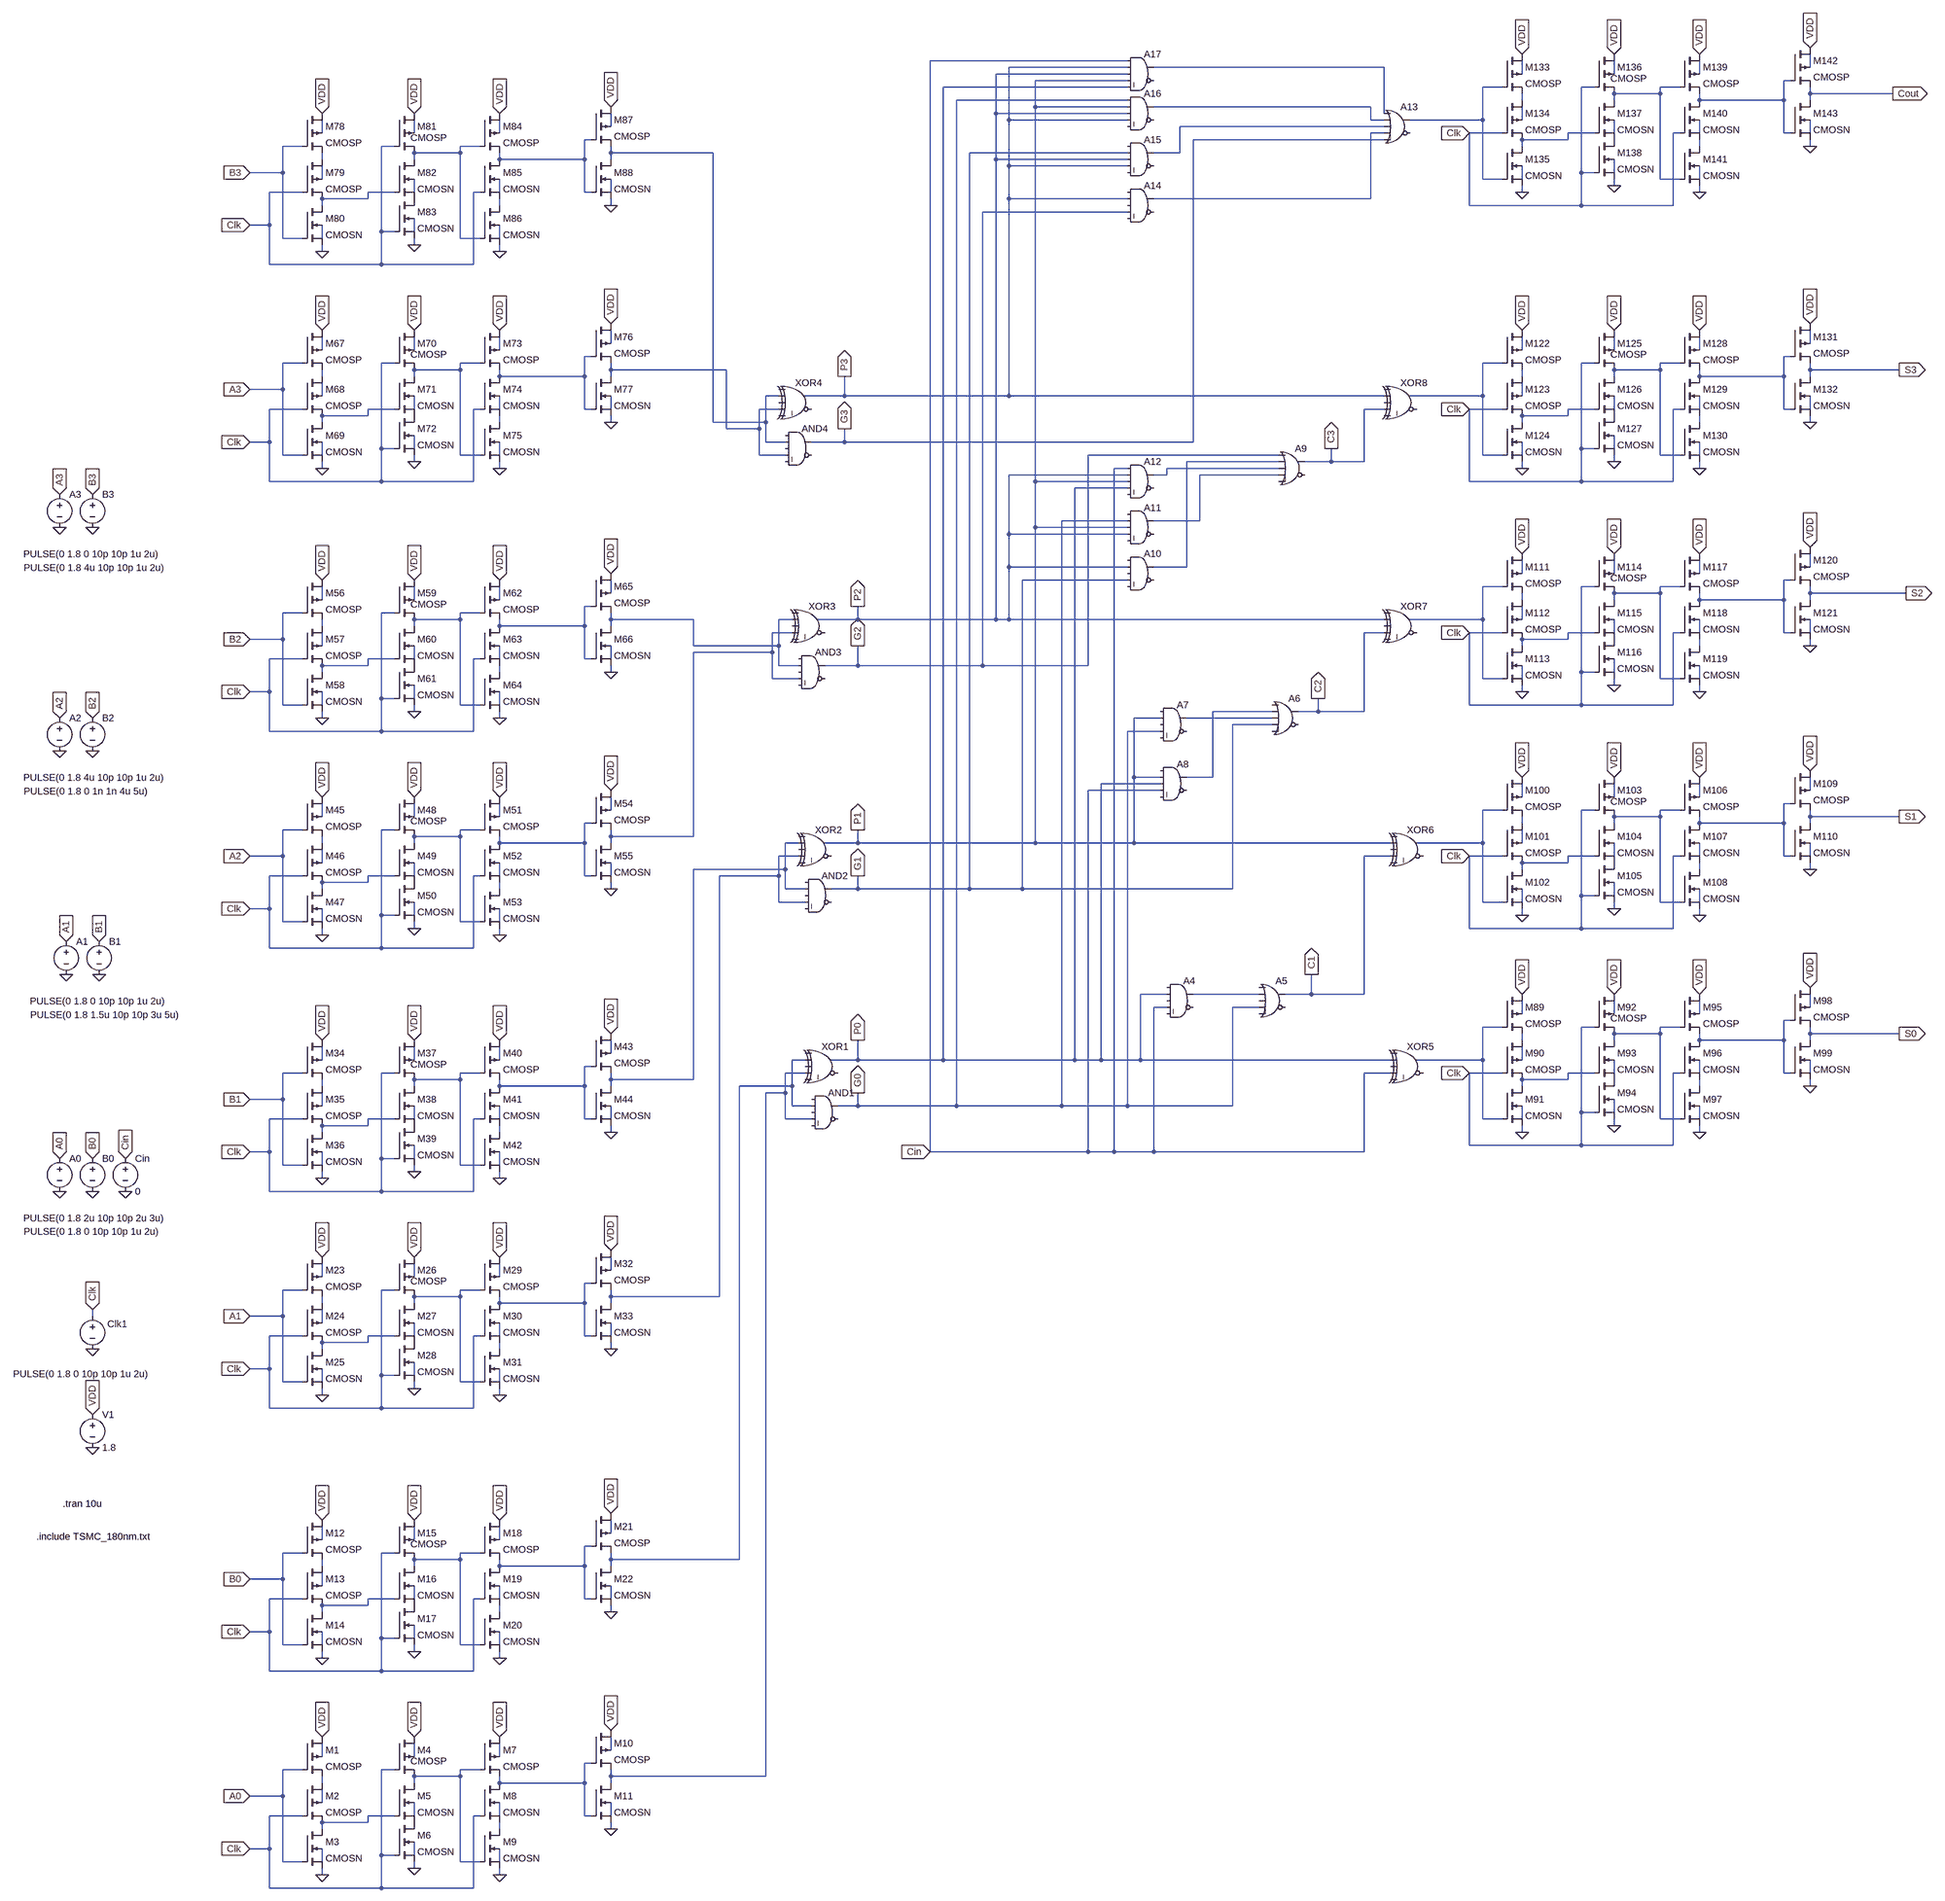
[diagram p0: schematic cla_adder_static_logic.asc]
* cla_adder_static_logic.asc
AND1 0 N161 0 N165 0 0 G0 0 AND
A§XOR1 0 N161 0 N165 0 0 P0 0 XOR
V§B0 B0 0 PULSE(0 1.8 0 10p 10p 1u 2u)
V§Cin Cin 0 0
V§A0 A0 0 PULSE(0 1.8 2u 10p 10p 2u 3u)
AND2 0 N128 0 N130 0 0 G1 0 AND
A§XOR2 0 N128 0 N130 0 0 P1 0 XOR
V§B1 B1 0 PULSE(0 1.8 1.5u 10p 10p 3u 5u)
V§A1 A1 0 PULSE(0 1.8 0 10p 10p 1u 2u)
AND3 0 N090 0 N093 0 0 G2 0 AND
A§XOR3 0 N090 0 N093 0 0 P2 0 XOR
V§B2 B2 0 PULSE(0 1.8 0 1n 1n 4u 5u)
V§A2 A2 0 PULSE(0 1.8 4u 10p 10p 1u 2u)
AND4 0 N025 0 N052 0 0 G3 0 AND
A§XOR4 0 N025 0 N052 0 0 P3 0 XOR
V§B3 B3 0 PULSE(0 1.8 4u 10p 10p 1u 2u)
V§A3 A3 0 PULSE(0 1.8 0 10p 10p 1u 2u)
A§XOR7 0 P2 0 C2 0 0 N081 0 XOR
A§XOR6 0 P1 0 C1 0 0 N119 0 XOR
A§XOR5 0 P0 0 Cin 0 0 N154 0 XOR
A§XOR8 0 P3 0 C3 0 0 N050 0 XOR
A4 0 P0 0 Cin 0 0 N148 0 AND
A5 0 N148 0 G0 0 0 C1 0 OR
A6 0 N111 N112 G1 0 0 C2 0 OR
A7 0 P1 0 G0 0 0 N112 0 AND
A8 0 P1 P0 Cin 0 0 N111 0 AND
A9 G2 N073 N074 N075 0 0 C3 0 OR
A10 0 P2 0 G1 0 0 N073 0 AND
A11 0 G0 P1 P2 0 0 N075 0 AND
A12 Cin P2 P1 P0 0 0 N074 0 AND
A13 N001 N010 N013 N017 G3 0 N007 0 OR
A14 0 P3 0 G2 0 0 N017 0 AND
A15 0 G1 P2 P3 0 0 N013 0 AND
A16 G0 P1 P2 P3 0 0 N010 0 AND
A17 Cin P3 P2 P1 P0 0 N001 0 AND
V§Clk1 Clk 0 PULSE(0 1.8 0 10p 10p 1u 2u)
V1 VDD 0 1.8
M1 VDD A0 N222 N217 CMOSP l=0.18u w=3.6u
M2 N222 Clk N224 N223 CMOSP l=0.18u w=3.6u
M3 N224 A0 0 N230 CMOSN l=0.18u w=1.8u
M4 VDD Clk N221 N218 CMOSP l=0.18u w=3.6u
M5 N221 N224 P001 N225 CMOSN l=0.18u w=1.8u
M6 P001 Clk 0 N229 CMOSN l=0.18u w=1.8u
M7 VDD N221 N220 N219 CMOSP l=0.18u w=3.6u
M8 N220 Clk N228 N226 CMOSN l=0.18u w=1.8u
M9 N228 N221 0 N231 CMOSN l=0.18u w=1.8u
M10 VDD N220 N165 N216 CMOSP l=0.18u w=3.6u
M11 N165 N220 0 N227 CMOSN l=0.18u w=1.8u
M12 VDD B0 N206 N201 CMOSP l=0.18u w=3.6u
M13 N206 Clk N208 N207 CMOSP l=0.18u w=3.6u
M14 N208 B0 0 N214 CMOSN l=0.18u w=1.8u
M15 VDD Clk N205 N202 CMOSP l=0.18u w=3.6u
M16 N205 N208 P002 N209 CMOSN l=0.18u w=1.8u
M17 P002 Clk 0 N213 CMOSN l=0.18u w=1.8u
M18 VDD N205 N204 N203 CMOSP l=0.18u w=3.6u
M19 N204 Clk N212 N210 CMOSN l=0.18u w=1.8u
M20 N212 N205 0 N215 CMOSN l=0.18u w=1.8u
M21 VDD N204 N161 N200 CMOSP l=0.18u w=3.6u
M22 N161 N204 0 N211 CMOSN l=0.18u w=1.8u
M23 VDD A1 N190 N185 CMOSP l=0.18u w=3.6u
M24 N190 Clk N192 N191 CMOSP l=0.18u w=3.6u
M25 N192 A1 0 N198 CMOSN l=0.18u w=1.8u
M26 VDD Clk N189 N186 CMOSP l=0.18u w=3.6u
M27 N189 N192 P003 N193 CMOSN l=0.18u w=1.8u
M28 P003 Clk 0 N197 CMOSN l=0.18u w=1.8u
M29 VDD N189 N188 N187 CMOSP l=0.18u w=3.6u
M30 N188 Clk N196 N194 CMOSN l=0.18u w=1.8u
M31 N196 N189 0 N199 CMOSN l=0.18u w=1.8u
M32 VDD N188 N130 N184 CMOSP l=0.18u w=3.6u
M33 N130 N188 0 N195 CMOSN l=0.18u w=1.8u
M34 VDD B1 N170 N158 CMOSP l=0.18u w=3.6u
M35 N170 Clk N174 N172 CMOSP l=0.18u w=3.6u
M36 N174 B1 0 N182 CMOSN l=0.18u w=1.8u
M37 VDD Clk N164 N159 CMOSP l=0.18u w=3.6u
M38 N164 N174 P004 N175 CMOSN l=0.18u w=1.8u
M39 P004 Clk 0 N181 CMOSN l=0.18u w=1.8u
M40 VDD N164 N163 N160 CMOSP l=0.18u w=3.6u
M41 N163 Clk N180 N176 CMOSN l=0.18u w=1.8u
M42 N180 N164 0 N183 CMOSN l=0.18u w=1.8u
M43 VDD N163 N128 N157 CMOSP l=0.18u w=3.6u
M44 N128 N163 0 N177 CMOSN l=0.18u w=1.8u
M45 VDD A2 N127 N121 CMOSP l=0.18u w=3.6u
M46 N127 Clk N137 N135 CMOSP l=0.18u w=3.6u
M47 N137 A2 0 N146 CMOSN l=0.18u w=1.8u
M48 VDD Clk N126 N122 CMOSP l=0.18u w=3.6u
M49 N126 N137 P005 N138 CMOSN l=0.18u w=1.8u
M50 P005 Clk 0 N145 CMOSN l=0.18u w=1.8u
M51 VDD N126 N124 N123 CMOSP l=0.18u w=3.6u
M52 N124 Clk N141 N139 CMOSN l=0.18u w=1.8u
M53 N141 N126 0 N147 CMOSN l=0.18u w=1.8u
M54 VDD N124 N093 N118 CMOSP l=0.18u w=3.6u
M55 N093 N124 0 N140 CMOSN l=0.18u w=1.8u
M56 VDD B2 N092 N084 CMOSP l=0.18u w=3.6u
M57 N092 Clk N100 N098 CMOSP l=0.18u w=3.6u
M58 N100 B2 0 N109 CMOSN l=0.18u w=1.8u
M59 VDD Clk N089 N085 CMOSP l=0.18u w=3.6u
M60 N089 N100 P006 N101 CMOSN l=0.18u w=1.8u
M61 P006 Clk 0 N108 CMOSN l=0.18u w=1.8u
M62 VDD N089 N088 N086 CMOSP l=0.18u w=3.6u
M63 N088 Clk N104 N102 CMOSN l=0.18u w=1.8u
M64 N104 N089 0 N110 CMOSN l=0.18u w=1.8u
M65 VDD N088 N090 N083 CMOSP l=0.18u w=3.6u
M66 N090 N088 0 N103 CMOSN l=0.18u w=1.8u
M67 VDD A3 N053 N041 CMOSP l=0.18u w=3.6u
M68 N053 Clk N057 N055 CMOSP l=0.18u w=3.6u
M69 N057 A3 0 N069 CMOSN l=0.18u w=1.8u
M70 VDD Clk N049 N042 CMOSP l=0.18u w=3.6u
M71 N049 N057 P007 N058 CMOSN l=0.18u w=1.8u
M72 P007 Clk 0 N067 CMOSN l=0.18u w=1.8u
M73 VDD N049 N047 N043 CMOSP l=0.18u w=3.6u
M74 N047 Clk N065 N059 CMOSN l=0.18u w=1.8u
M75 N065 N049 0 N070 CMOSN l=0.18u w=1.8u
M76 VDD N047 N052 N039 CMOSP l=0.18u w=3.6u
M77 N052 N047 0 N060 CMOSN l=0.18u w=1.8u
M78 VDD B3 N026 N014 CMOSP l=0.18u w=3.6u
M79 N026 Clk N031 N028 CMOSP l=0.18u w=3.6u
M80 N031 B3 0 N037 CMOSN l=0.18u w=1.8u
M81 VDD Clk N023 N015 CMOSP l=0.18u w=3.6u
M82 N023 N031 P008 N032 CMOSN l=0.18u w=1.8u
M83 P008 Clk 0 N036 CMOSN l=0.18u w=1.8u
M84 VDD N023 N022 N016 CMOSP l=0.18u w=3.6u
M85 N022 Clk N035 N033 CMOSN l=0.18u w=1.8u
M86 N035 N023 0 N038 CMOSN l=0.18u w=1.8u
M87 VDD N022 N025 N012 CMOSP l=0.18u w=3.6u
M88 N025 N022 0 N034 CMOSN l=0.18u w=1.8u
M89 VDD N154 N156 N150 CMOSP l=0.18u w=3.6u
M90 N156 Clk N166 N162 CMOSP l=0.18u w=3.6u
M91 N166 N154 0 N178 CMOSN l=0.18u w=1.8u
M92 VDD Clk N155 N151 CMOSP l=0.18u w=3.6u
M93 N155 N166 P009 N167 CMOSN l=0.18u w=1.8u
M94 P009 Clk 0 N173 CMOSN l=0.18u w=1.8u
M95 VDD N155 N153 N152 CMOSP l=0.18u w=3.6u
M96 N153 Clk N171 N168 CMOSN l=0.18u w=1.8u
M97 N171 N155 0 N179 CMOSN l=0.18u w=1.8u
M98 VDD N153 S0 N149 CMOSP l=0.18u w=3.6u
M99 S0 N153 0 N169 CMOSN l=0.18u w=1.8u
M100 VDD N119 N125 N114 CMOSP l=0.18u w=3.6u
M101 N125 Clk N131 N129 CMOSP l=0.18u w=3.6u
M102 N131 N119 0 N143 CMOSN l=0.18u w=1.8u
M103 VDD Clk N120 N115 CMOSP l=0.18u w=3.6u
M104 N120 N131 P010 N132 CMOSN l=0.18u w=1.8u
M105 P010 Clk 0 N142 CMOSN l=0.18u w=1.8u
M106 VDD N120 N117 N116 CMOSP l=0.18u w=3.6u
M107 N117 Clk N136 N133 CMOSN l=0.18u w=1.8u
M108 N136 N120 0 N144 CMOSN l=0.18u w=1.8u
M109 VDD N117 S1 N113 CMOSP l=0.18u w=3.6u
M110 S1 N117 0 N134 CMOSN l=0.18u w=1.8u
M111 VDD N081 N087 N077 CMOSP l=0.18u w=3.6u
M112 N087 Clk N094 N091 CMOSP l=0.18u w=3.6u
M113 N094 N081 0 N106 CMOSN l=0.18u w=1.8u
M114 VDD Clk N082 N078 CMOSP l=0.18u w=3.6u
M115 N082 N094 P011 N095 CMOSN l=0.18u w=1.8u
M116 P011 Clk 0 N105 CMOSN l=0.18u w=1.8u
M117 VDD N082 N080 N079 CMOSP l=0.18u w=3.6u
M118 N080 Clk N099 N096 CMOSN l=0.18u w=1.8u
M119 N099 N082 0 N107 CMOSN l=0.18u w=1.8u
M120 VDD N080 S2 N076 CMOSP l=0.18u w=3.6u
M121 S2 N080 0 N097 CMOSN l=0.18u w=1.8u
M122 VDD N050 N054 N044 CMOSP l=0.18u w=3.6u
M123 N054 Clk N061 N056 CMOSP l=0.18u w=3.6u
M124 N061 N050 0 N071 CMOSN l=0.18u w=1.8u
M125 VDD Clk N051 N045 CMOSP l=0.18u w=3.6u
M126 N051 N061 P012 N062 CMOSN l=0.18u w=1.8u
M127 P012 Clk 0 N068 CMOSN l=0.18u w=1.8u
M128 VDD N051 N048 N046 CMOSP l=0.18u w=3.6u
M129 N048 Clk N066 N063 CMOSN l=0.18u w=1.8u
M130 N066 N051 0 N072 CMOSN l=0.18u w=1.8u
M131 VDD N048 S3 N040 CMOSP l=0.18u w=3.6u
M132 S3 N048 0 N064 CMOSN l=0.18u w=1.8u
M133 VDD N007 N009 N003 CMOSP l=0.18u w=3.6u
M134 N009 Clk N018 N011 CMOSP l=0.18u w=3.6u
M135 N018 N007 0 N029 CMOSN l=0.18u w=1.8u
M136 VDD Clk N008 N004 CMOSP l=0.18u w=3.6u
M137 N008 N018 P013 N019 CMOSN l=0.18u w=1.8u
M138 P013 Clk 0 N027 CMOSN l=0.18u w=1.8u
M139 VDD N008 N006 N005 CMOSP l=0.18u w=3.6u
M140 N006 Clk N024 N020 CMOSN l=0.18u w=1.8u
M141 N024 N008 0 N030 CMOSN l=0.18u w=1.8u
M142 VDD N006 Cout N002 CMOSP l=0.18u w=3.6u
M143 Cout N006 0 N021 CMOSN l=0.18u w=1.8u
.model NMOS NMOS
.model PMOS PMOS
.lib standard.mos
.tran 10u
.include TSMC_180nm.txt
.backanno
.end